# Altium schematic sheet Connectors.SchDoc: Connectors
size OrCAD A; Date: Not used; ApprovedBy: Not used; CheckedBy: Not used; Author: Not used; CompanyName: STMicroelectronics; DrawnBy: Not used; Engineer: Not used; Organization: Not used; Address1: Not used; Address2: Not used; Address3: Not used; Address4: Not used; DocumentNumber: 5; Revision: Not used; SheetNumber: 5; SheetTotal: 9; CurrentTime: Not used; CurrentDate: Not used; Time: Not used; DocumentFullPathAndName: Not used; DocumentName: Not used; ModifiedDate: Not used; ImagePath: Not used; ProjectName: Not used; Application_BuildNumber: Not used
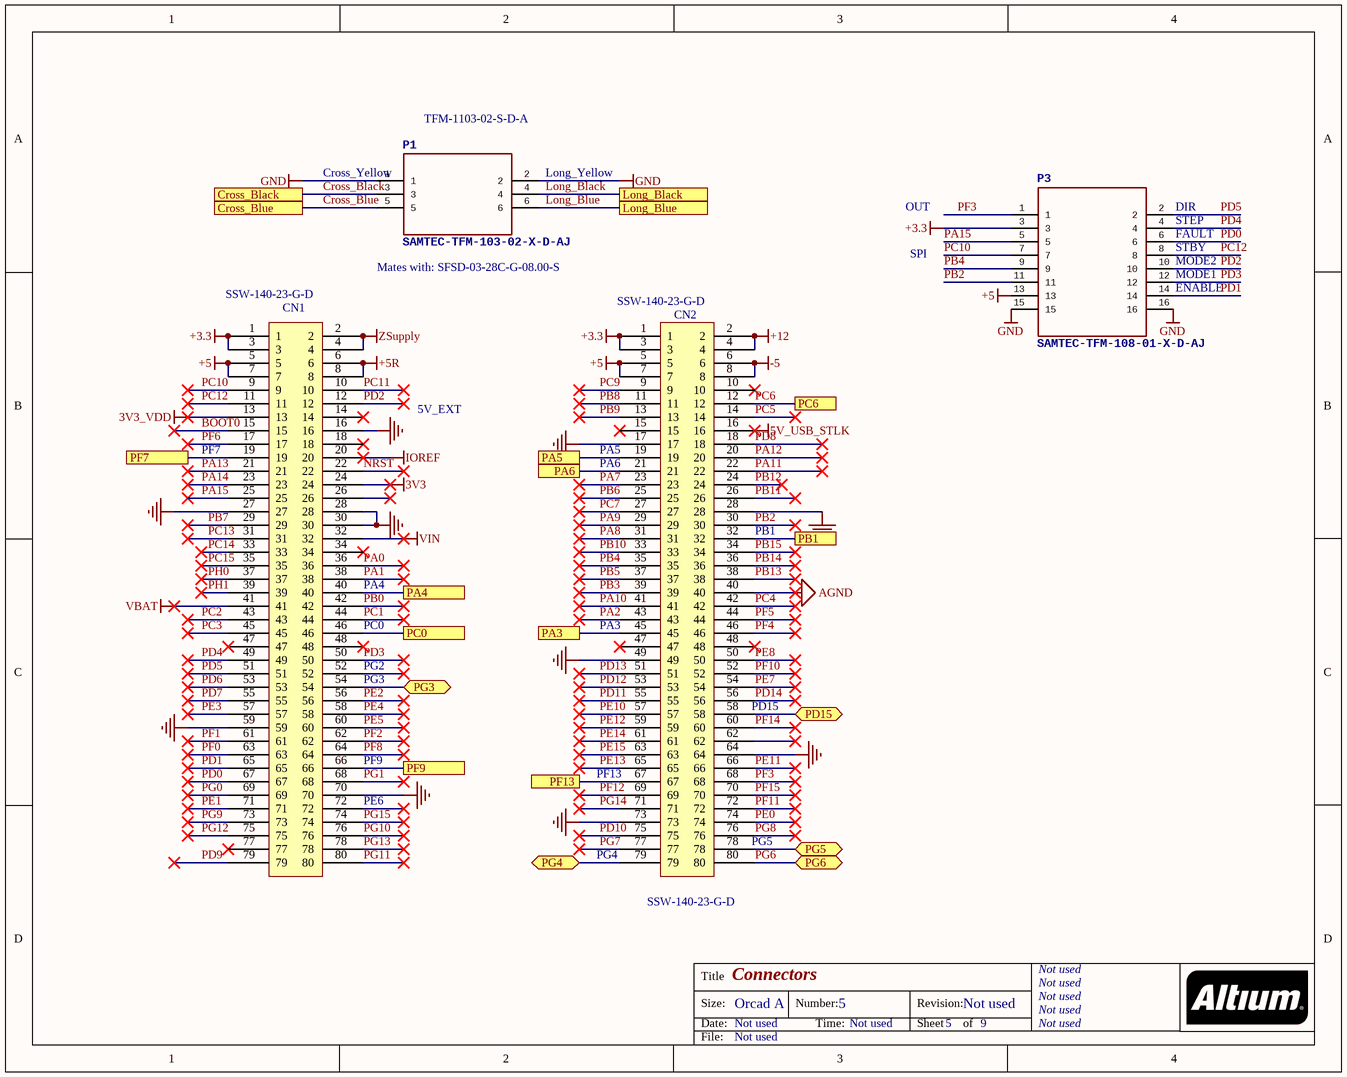
[diagram p0: Connectors.SchDoc]

## Parts
CN1  SSW-140-23-G-D  [SSW-140-23-G-D]
CN2  SSW-140-23-G-D  [SSW-140-23-G-D]
P1  SAMTEC-TFM-103-02-X-D-AJ  [SAMTEC-TFM-103-02-X-D-A]
P3  SAMTEC-TFM-108-01-X-D-AJ  [SAMTEC-TFM-108-01-X-D-A]

## Ports
Cross_Black, Cross_Blue, Long_Black, Long_Blue, PA3, PA4, PA5, PA6, PB1, PC0, PC6, PD15, PF7, PF9, PF13, PG3, PG4, PG5, PG6

## Nets
3V3: CN1.24
3V3_VDD: CN1.13
5V_USB_STLK: CN2.16
+3.3: CN1.1 CN1.3 CN2.1 CN2.3 P3.3
+5: CN1.5 CN1.7 CN2.5 CN2.7 P3.13
+5R: CN1.6 CN1.8
+12: CN2.2 CN2.4
-5: CN2.6 CN2.8
AGND: CN2.40
GND: CN1.16 CN1.27 CN1.28 CN1.30 CN1.59 CN1.70 CN2.17 CN2.28 CN2.49 CN2.64 CN2.73 P1.1 P1.2 P3.15 P3.16
IOREF: CN1.20
VBAT: CN1.41
VIN: CN1.32
ZSupply: CN1.2 CN1.4
BOOT0: CN1.15
Cross_Black: P1.3 ; port Cross_Black
Cross_Blue: P1.5 ; port Cross_Blue
Long_Black: P1.4 ; port Long_Black
Long_Blue: P1.6 ; port Long_Blue
NRST: CN1.22
PA0: CN1.36
PA1: CN1.38
PA2: CN2.43
PA3: CN2.45 ; port PA3
PA4: CN1.40 ; port PA4
PA5: CN2.19 ; port PA5
PA6: CN2.21 ; port PA6
PA7: CN2.23
PA8: CN2.31
PA9: CN2.29
PA10: CN2.41
PA11: CN2.22
PA12: CN2.20
PA13: CN1.21
PA14: CN1.23
PA15: CN1.25 P3.5
PB0: CN1.42
PB1: CN2.32 ; port PB1
PB2: CN2.30 P3.11
PB3: CN2.39
PB4: CN2.35 P3.9
PB5: CN2.37
PB6: CN2.25
PB7: CN1.29
PB8: CN2.11
PB9: CN2.13
PB10: CN2.33
PB11: CN2.26
PB12: CN2.24
PB13: CN2.38
PB14: CN2.36
PB15: CN2.34
PC0: CN1.46 ; port PC0
PC1: CN1.44
PC2: CN1.43
PC3: CN1.45
PC4: CN2.42
PC5: CN2.14
PC6: CN2.12 ; port PC6
PC7: CN2.27
PC9: CN2.9
PC10: CN1.9 P3.7
PC11: CN1.10
PC12: CN1.11 P3.8
PC13: CN1.31
PC14: CN1.33
PC15: CN1.35
PD0: CN1.67 P3.6
PD1: CN1.65 P3.14
PD2: CN1.12 P3.10
PD3: CN1.50 P3.12
PD4: CN1.49 P3.4
PD5: CN1.51 P3.2
PD6: CN1.53
PD7: CN1.55
PD8: CN2.18
PD9: CN1.79
PD10: CN2.75
PD11: CN2.55
PD12: CN2.53
PD13: CN2.51
PD14: CN2.56
PD15: CN2.58 ; port PD15
PE0: CN2.74
PE1: CN1.71
PE2: CN1.56
PE3: CN1.57
PE4: CN1.58
PE5: CN1.60
PE7: CN2.54
PE8: CN2.50
PE10: CN2.57
PE11: CN2.66
PE12: CN2.59
PE13: CN2.65
PE14: CN2.61
PE15: CN2.63
PF0: CN1.63
PF1: CN1.61
PF2: CN1.62
PF3: CN2.68 P3.1
PF4: CN2.46
PF5: CN2.44
PF6: CN1.17
PF7: CN1.19 ; port PF7
PF8: CN1.64
PF9: CN1.66 ; port PF9
PF10: CN2.52
PF11: CN2.72
PF12: CN2.69
PF13: CN2.67 ; port PF13
PF14: CN2.60
PF15: CN2.70
PG0: CN1.69
PG1: CN1.68
PG3: CN1.54 ; port PG3
PG4: CN2.79 ; port PG4
PG5: CN2.78 ; port PG5
PG6: CN2.80 ; port PG6
PG7: CN2.77
PG8: CN2.76
PG9: CN1.73
PG10: CN1.76
PG11: CN1.80
PG12: CN1.75
PG13: CN1.78
PG14: CN2.71
PG15: CN1.74
PH0: CN1.37
PH1: CN1.39

Not connected (* = marked no-connect by the designer): CN1 14* 18* 26* 34* 47* 48* 52* 72* 77*; CN2 10* 15* 47* 48* 62*

## Notes on the sheet
- TFM-1103-02-S-D-A
- (near P1) Cross_Yellow
- (near P1) Long_Yellow
- OUT
- (near P3) DIR
- Mates with: SFSD-03-28C-G-08.00-S
- SPI
- (near P3) STEP
- (near P3) FAULT
- (near P3) STBY
- (near P3) MODE2
- (near P3) MODE1
- (near P3) ENABLE
- 5V_EXT
- (near CN1) PF7
- (near CN2) PA6
- (near CN2) PA5
- (near CN2) PB1
- (near CN1) PA4
- (near CN1) PG2
- (near CN1) PG3
- (near CN1) PC0
- (near CN2) PA3
- (near CN2) PD15
- (near CN1) PE6
- (near CN1) PF9
- (near CN2) PF13
- (near CN2) PG4
- (near CN2) PG5
- Title
- Size:
- Date:
- Orcad A
- Number:
- Time:
- Revision:
- Sheet
- of
- File:

## Library data of the parts
CN1 CN2 = SSW-140-23-G-D: 80 Position Receptacle Connector Through Hole; Manufacturer: Samtec; Number of Contacts: 80; Gender: Female; Pitch: 2.54mm; Supplier 1: Avnet; Supplier Part Number 1: SSW-140-23-G-D; Manufacturer Part Number: SSW-140-23-G-D; Stock 1: 0; Pricing 1: 1=13.99000, 10=13.29000, 25=12.59000, 50=12.09000, 100=11.29000 (USD); RoHS: Yes; Mount: Through Hole; Contact Plating: Gold; Number of Rows: 2; Packaging: Bulk; Termination: Solder; Radiation Hardening: No; ComponentLink1URL: http://www.samtec.com/documents/webfiles/pdf/SSQ_TH.PDF?src-supplier=Avnet; ComponentLink1Description: http://www.samtec.com/documents/webfiles/pdf/SSQ_TH.PDF?src-supplier=Avnet